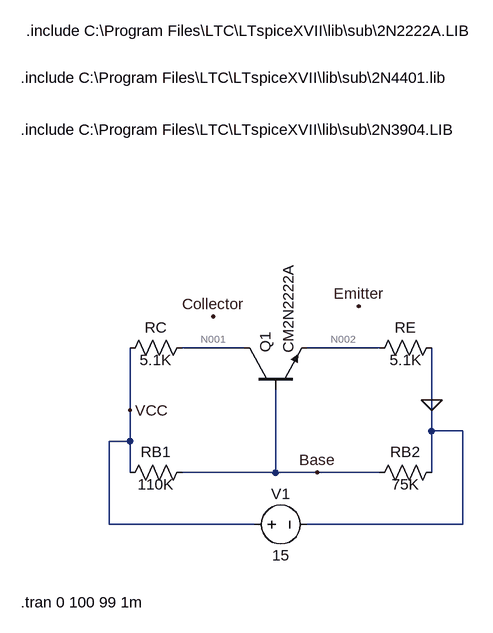
[diagram p0: schematic mp2 task 1 d replaced with 2222.asc]
mp2 task 1 d replaced with 2222.asc, the LTspice schematic file:
Version 4
SHEET 1 1276 680
WIRE 240 80 144 80
WIRE 448 80 336 80
WIRE 528 160 528 80
WIRE 64 176 64 80
WIRE 528 208 528 160
WIRE 576 208 528 208
WIRE 64 224 64 176
WIRE 64 224 32 224
WIRE 64 272 64 224
WIRE 288 272 288 144
WIRE 288 272 144 272
WIRE 352 272 288 272
WIRE 448 272 352 272
WIRE 528 272 528 208
WIRE 32 352 32 224
WIRE 256 352 32 352
WIRE 576 352 576 208
WIRE 576 352 336 352
FLAG 64 176 VCC
FLAG 528 160 0
FLAG 192 32 Collector
FLAG 416 16 Emitter
FLAG 352 272 Base
SYMBOL res 48 96 R270
WINDOW 0 32 56 VTop 2
WINDOW 3 -18 56 VTop 2
SYMATTR InstName RC
SYMATTR Value 5.1K
SYMBOL res 432 96 R270
WINDOW 0 32 56 VTop 2
WINDOW 3 -18 56 VTop 2
SYMATTR InstName RE
SYMATTR Value 5.1K
SYMBOL res 432 288 R270
WINDOW 0 32 56 VTop 2
WINDOW 3 -18 56 VTop 2
SYMATTR InstName RB2
SYMATTR Value 75K
SYMBOL res 48 288 R270
WINDOW 0 32 56 VTop 2
WINDOW 3 -18 56 VTop 2
SYMATTR InstName RB1
SYMATTR Value 110K
SYMBOL npn 240 144 R270
SYMATTR InstName Q1
SYMATTR Value CM2N2222A
SYMBOL voltage 240 352 R270
WINDOW 0 32 56 VTop 2
WINDOW 3 -32 56 VBottom 2
WINDOW 123 0 0 Left 0
WINDOW 39 0 0 Left 0
SYMATTR InstName V1
SYMATTR Value 15
TEXT -104 -256 Left 2 !.include C:\\Program Files\\LTC\\LTspiceXVII\\lib\\sub\\2N3904.LIB
TEXT -104 472 Left 2 !.tran 0 100 99 1m
TEXT -104 -336 Left 2 !.include C:\\Program Files\\LTC\\LTspiceXVII\\lib\\sub\\2N4401.lib
TEXT -96 -408 Left 2 !.include C:\\Program Files\\LTC\\LTspiceXVII\\lib\\sub\\2N2222A.LIB

The netlist it stands for:
* mp2 task 1 d replaced with 2222.asc
RC VCC N001 5.1K
RE N002 0 5.1K
RB2 Base 0 75K
RB1 VCC Base 110K
Q1 N001 Base N002 0 CM2N2222A
V1 VCC 0 15
.model NPN NPN
.model PNP PNP
.lib standard.bjt
.include C:\Program Files\LTC\LTspiceXVII\lib\sub\2N3904.LIB
.tran 0 100 99 1m
.include C:\Program Files\LTC\LTspiceXVII\lib\sub\2N4401.lib
.include C:\Program Files\LTC\LTspiceXVII\lib\sub\2N2222A.LIB
.backanno
.end

* Results of the author's LTspice run, read from the files saved beside the schematic
* Operating Point, zero values left out:
*   V(vcc) = 15 V
*   V(n001) = 9.823 V
*   V(n002) = 5.208 V
*   V(base) = 5.809 V
*   Ic(Q1) = 1.015 mA
*   Ib(Q1) = 6.091 µA
*   Ie(Q1) = -1.021 mA
*   I(Rb1) = 83.55 µA
*   I(Rb2) = 77.46 µA
*   I(Re) = 1.021 mA
*   I(Rc) = 1.015 mA
*   I(V1) = -1.099 mA
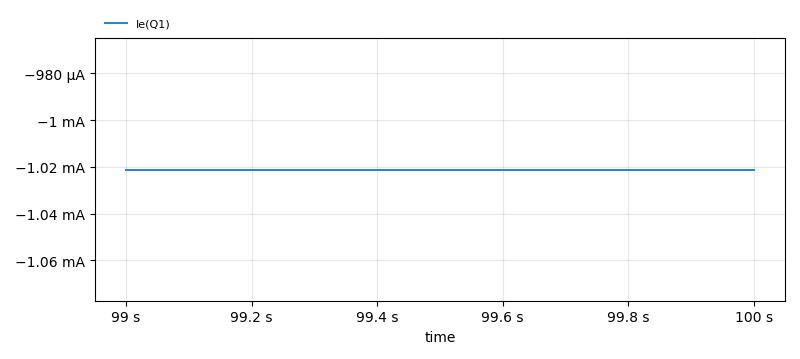
[diagram p1: Transient Analysis of mp2 task 1 d replaced with 2222.asc, plotted from the saved traces]
* Transient Analysis, 1 run:
*   Ie(Q1): min -1.021 mA, max -1.021 mA, average -1.021 mA, rms 1.021 mA, last -1.021 mA